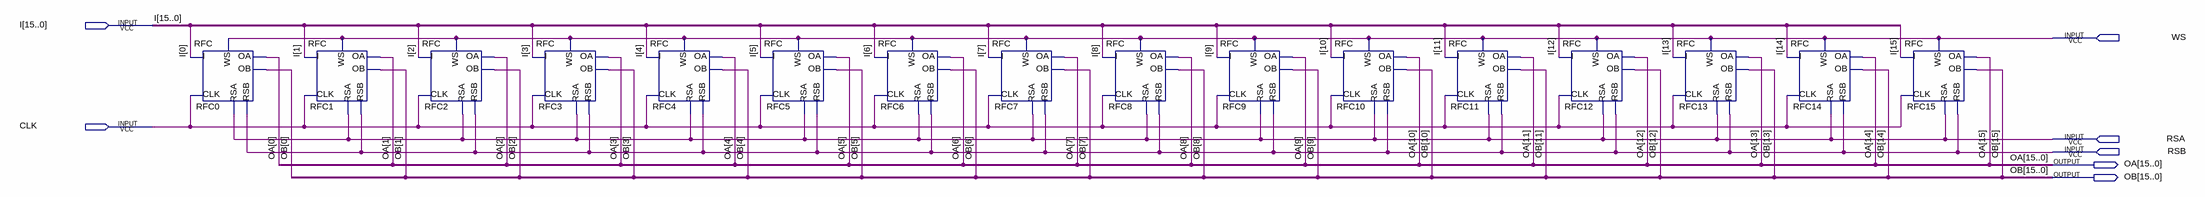
[diagram p0: schematic sheet]
// Quartus schematic RFC16.bdf as structural Verilog: 16 symbols, 7 pins
module RFC16 (
  input  [15:0] I,
  input  WS,
  input  CLK,
  input  RSA,
  input  RSB,
  output [15:0] OA,
  output [15:0] OB
);

  RFC RFC0 (.RSB(RSB), .RSA(RSA), .WS(WS), .I(I[0]), .CLK(CLK), .OA(OA[0]), .OB(OB[0]));
  RFC RFC1 (.RSB(RSB), .RSA(RSA), .WS(WS), .I(I[1]), .CLK(CLK), .OA(OA[1]), .OB(OB[1]));
  RFC RFC2 (.RSB(RSB), .RSA(RSA), .WS(WS), .I(I[2]), .CLK(CLK), .OA(OA[2]), .OB(OB[2]));
  RFC RFC3 (.RSB(RSB), .RSA(RSA), .WS(WS), .I(I[3]), .CLK(CLK), .OA(OA[3]), .OB(OB[3]));
  RFC RFC4 (.RSB(RSB), .RSA(RSA), .WS(WS), .I(I[4]), .CLK(CLK), .OA(OA[4]), .OB(OB[4]));
  RFC RFC5 (.RSB(RSB), .RSA(RSA), .WS(WS), .I(I[5]), .CLK(CLK), .OA(OA[5]), .OB(OB[5]));
  RFC RFC6 (.RSB(RSB), .RSA(RSA), .WS(WS), .I(I[6]), .CLK(CLK), .OA(OA[6]), .OB(OB[6]));
  RFC RFC7 (.RSB(RSB), .RSA(RSA), .WS(WS), .I(I[7]), .CLK(CLK), .OA(OA[7]), .OB(OB[7]));
  RFC RFC8 (.RSB(RSB), .RSA(RSA), .WS(WS), .I(I[8]), .CLK(CLK), .OA(OA[8]), .OB(OB[8]));
  RFC RFC9 (.RSB(RSB), .RSA(RSA), .WS(WS), .I(I[9]), .CLK(CLK), .OA(OA[9]), .OB(OB[9]));
  RFC RFC10 (.RSB(RSB), .RSA(RSA), .WS(WS), .I(I[10]), .CLK(CLK), .OA(OA[10]), .OB(OB[10]));
  RFC RFC11 (.RSB(RSB), .RSA(RSA), .WS(WS), .I(I[11]), .CLK(CLK), .OA(OA[11]), .OB(OB[11]));
  RFC RFC12 (.RSB(RSB), .RSA(RSA), .WS(WS), .I(I[12]), .CLK(CLK), .OA(OA[12]), .OB(OB[12]));
  RFC RFC13 (.RSB(RSB), .RSA(RSA), .WS(WS), .I(I[13]), .CLK(CLK), .OA(OA[13]), .OB(OB[13]));
  RFC RFC14 (.RSB(RSB), .RSA(RSA), .WS(WS), .I(I[14]), .CLK(CLK), .OA(OA[14]), .OB(OB[14]));
  RFC RFC15 (.RSB(RSB), .RSA(RSA), .WS(WS), .I(I[15]), .CLK(CLK), .OA(OA[15]), .OB(OB[15]));
endmodule
